# EAGLE schematic UmnitsaControl (EAGLE 9.3.0)
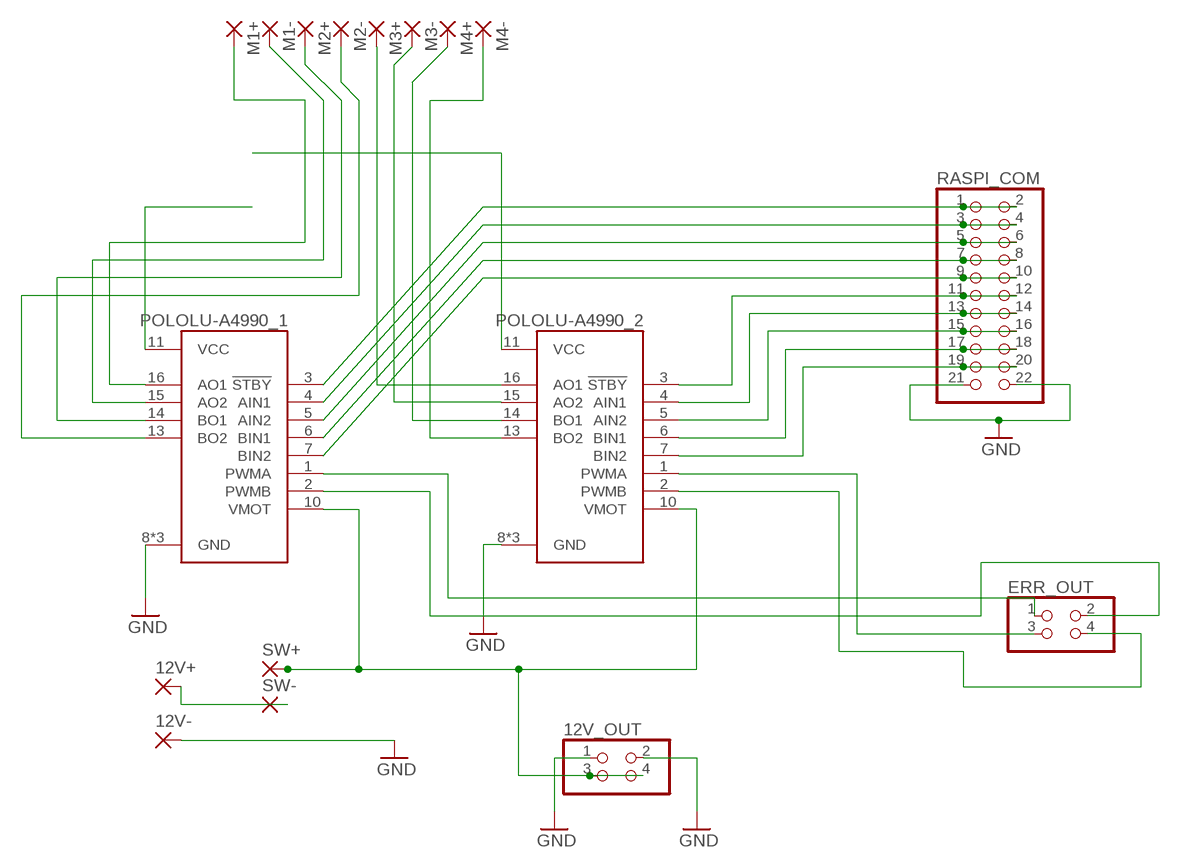
[diagram p0: schematic, sheet 1]

## Parts
12V+  3,81/1,4  [3,81/1,4]
12V-  3,81/1,4  [3,81/1,4]
12V_OUT  PINHD-2X2  [2X02]
ERR_OUT  PINHD-2X2  [2X02]
M1+  3,81/1,4  [3,81/1,4]
M1-  3,81/1,4  [3,81/1,4]
M2+  3,81/1,4  [3,81/1,4]
M2-  3,81/1,4  [3,81/1,4]
M3+  3,81/1,4  [3,81/1,4]
M3-  3,81/1,4  [3,81/1,4]
M4+  3,81/1,4  [3,81/1,4]
M4-  3,81/1,4  [3,81/1,4]
POLOLU-A4990_1  POLOLU-713  [SHIELD_POLOLU-713]
POLOLU-A4990_2  POLOLU-713  [SHIELD_POLOLU-713]
RASPI_COM  PINHD-2X11  [2X11]
SW+  2,54/1,0  [2,54/1,0]
SW-  2,54/1,0  [2,54/1,0]

## Nets
GND [Power]: 12V-.1(P) 12V_OUT.1 12V_OUT.2 POLOLU-A4990_1.8(GND) POLOLU-A4990_1.9(GND) POLOLU-A4990_1.12(GND) POLOLU-A4990_2.8(GND) POLOLU-A4990_2.9(GND) POLOLU-A4990_2.12(GND) RASPI_COM.21 RASPI_COM.22
N$1 [Motor]: M1+.1(P) POLOLU-A4990_1.16(AO1)
N$2 [Motor]: M1-.1(P) POLOLU-A4990_1.15(AO2)
N$3: 12V+.1(P) SW-.1(P)
N$4 [Motor]: M2+.1(P) POLOLU-A4990_1.14(BO1)
N$5 [Motor]: M2-.1(P) POLOLU-A4990_1.13(BO2)
N$6 [Motor]: M3+.1(P) POLOLU-A4990_2.16(AO1)
N$7 [Motor]: M3-.1(P) POLOLU-A4990_2.15(AO2)
N$8 [Motor]: M4+.1(P) POLOLU-A4990_2.14(BO1)
N$9 [Motor]: M4-.1(P) POLOLU-A4990_2.13(BO2)
N$10: POLOLU-A4990_2.3(!STBY) RASPI_COM.11 RASPI_COM.12
N$11: POLOLU-A4990_2.7(BIN2) RASPI_COM.19 RASPI_COM.20
N$12: POLOLU-A4990_2.6(BIN1) RASPI_COM.17 RASPI_COM.18
N$13: POLOLU-A4990_2.5(AIN2) RASPI_COM.15 RASPI_COM.16
N$14: POLOLU-A4990_2.4(AIN1) RASPI_COM.13 RASPI_COM.14
N$15: POLOLU-A4990_1.3(!STBY) RASPI_COM.1 RASPI_COM.2
N$16: POLOLU-A4990_1.4(AIN1) RASPI_COM.3 RASPI_COM.4
N$17: POLOLU-A4990_1.5(AIN2) RASPI_COM.5 RASPI_COM.6
N$18: POLOLU-A4990_1.6(BIN1) RASPI_COM.7 RASPI_COM.8
N$19: POLOLU-A4990_1.7(BIN2) RASPI_COM.9 RASPI_COM.10
N$21: ERR_OUT.3 POLOLU-A4990_2.1(PWMA)
N$22 [Low Power]: POLOLU-A4990_2.11(VCC)
N$23: ERR_OUT.4 POLOLU-A4990_2.2(PWMB)
N$25: ERR_OUT.1 POLOLU-A4990_1.1(PWMA)
N$26: ERR_OUT.2 POLOLU-A4990_1.2(PWMB)
N$27 [Low Power]: POLOLU-A4990_1.11(VCC)
N$28: 12V_OUT.3 12V_OUT.4 POLOLU-A4990_1.10(VMOT) POLOLU-A4990_2.10(VMOT) SW+.1(P)

## Library data of the parts
12V+ 12V- M1+ M1- M2+ M2- M3+ M3- M4+ M4- = wirepad:3,81/1,4: THROUGH-HOLE PAD
12V_OUT ERR_OUT = pinhead:PINHD-2X2: PIN HEADER
POLOLU-A4990_1 POLOLU-A4990_2 = POLOLU-A4990:POLOLU-713: DC-motor driver; IC: TB6612FNG; 100kHz; 1A; Uin mot: 4.5; AVAILABILITY: Unavailable; DESCRIPTION: DC-motor driver; IC: TB6612FNG; 100kHz; 1A; Uin mot: 4.5; MF: Pololu; MP: POLOLU-713; PACKAGE: None; PRICE: None
RASPI_COM = pinhead:PINHD-2X11: PIN HEADER
SW+ SW- = wirepad:2,54/1,0: THROUGH-HOLE PAD

## Net classes
0 default: width 0.406 mm, clearance 0.406 mm
1 Power: width 3.048 mm, clearance 0.406 mm
2 Motor: width 1.016 mm, clearance 0.406 mm
3 Low Power: width 3.048 mm, clearance 0.406 mm